# Altium schematic sheet JunPuMBUS.SchDoc
size A3
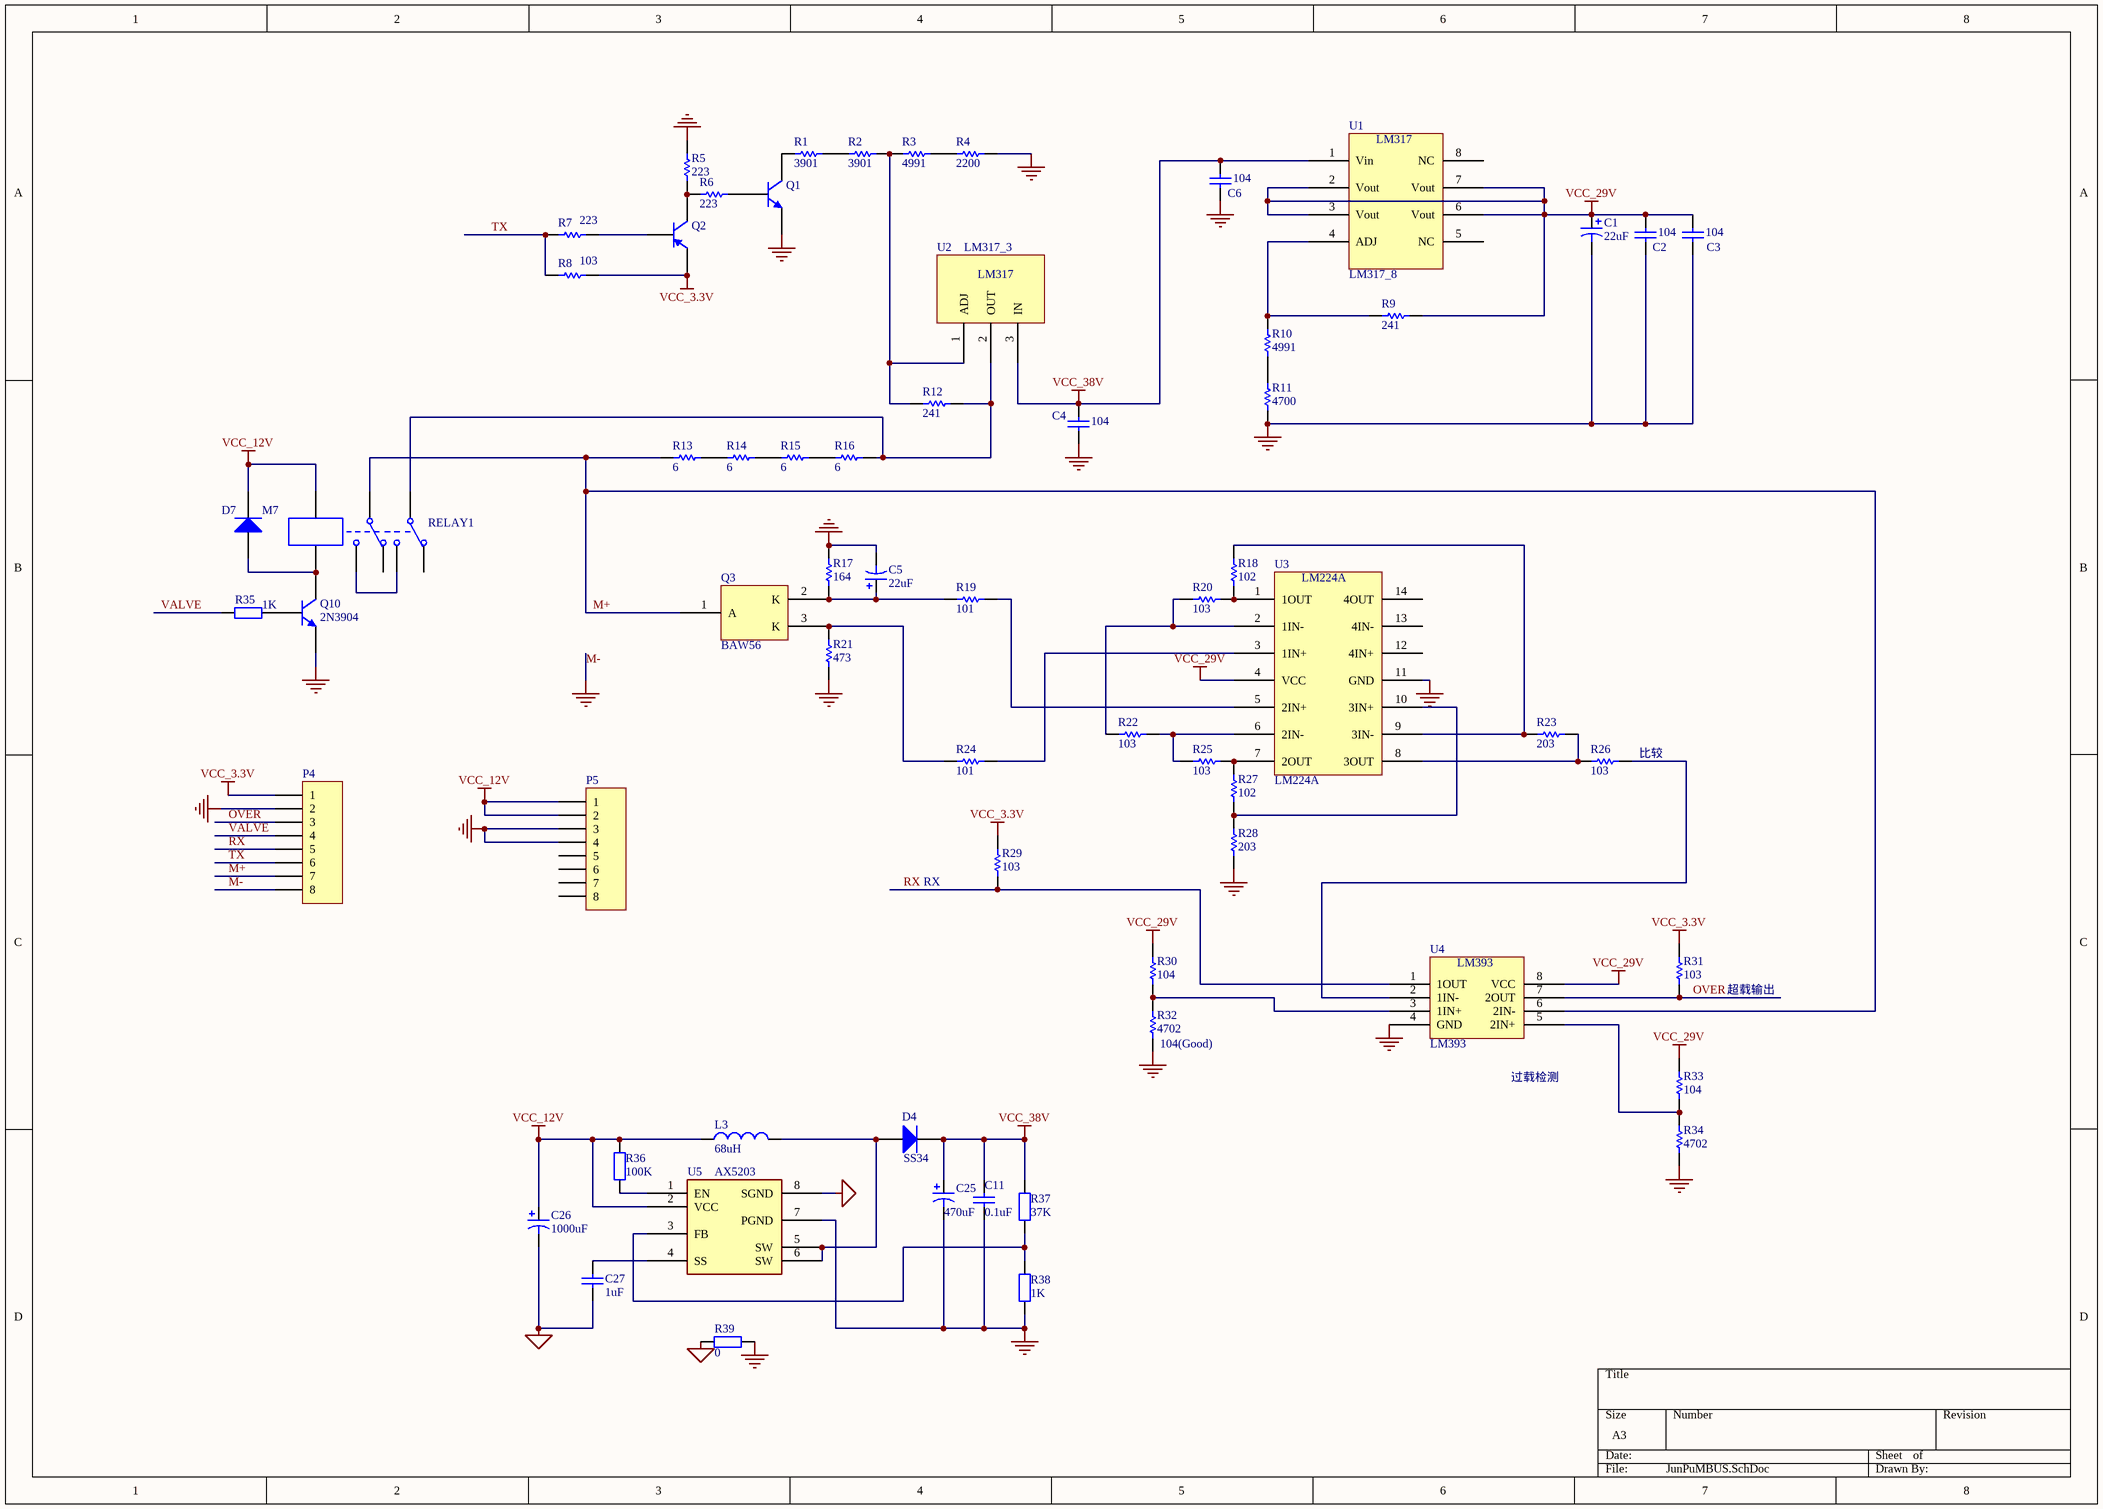
[diagram p0: JunPuMBUS.SchDoc]

## Parts
C1  value 22uF  [C_6.3_5.3]  (hidden comment: Cap Pol3)
C2  value 104  [0603]  (hidden comment: Cap)
C3  value 104  [0603]  (hidden comment: Cap)
C4  value 104  [0603]  (hidden comment: Cap)
C5  value 22uF  [C_6.3_5.3]  (hidden comment: Cap Pol3)
C6  value 104  [0603]  (hidden comment: Cap)
C11  value 0.1uF  [0603]  (hidden comment: Cap)
C25  value 470uF  [C_DJ - duplicate]  (hidden comment: Cap Pol1)
C26  value 1000uF  [C_DJ - duplicate]  (hidden comment: Cap Pol1)
C27  value 1uF  [0603]  (hidden comment: Cap)
D4  SS34  [M7-4007]
D7  M7  [M7-4007]
L3  value 68uH  [L12*12]  (hidden comment: Inductor)
P4  Header 8  [HDR1X8]  (value not drawn)
P5  Header 8  [HDR1X8]  (value not drawn)
Q1  NPN  [SOT-23]  (value not drawn)
Q2  PNP  [SOT-23]  (value not drawn)
Q3  BAW56  [SOT-23]
Q10  2N3904  [NPN-PNP]
R1  value 3901  [1206]  (hidden comment: Res1)
R2  value 3901  [1206]  (hidden comment: Res1)
R3  value 4991  [1206]  (hidden comment: Res1)
R4  value 2200  [1206]  (hidden comment: Res1)
R5  value 223  [0603]  (hidden comment: Res1)
R6  value 223  [0603]  (hidden comment: Res1)
R7  value 223  [0603]  (hidden comment: Res1)
R8  value 103  [0603]  (hidden comment: Res1)
R9  value 241  [1206]  (hidden comment: Res1)
R10  value 4991  [1206]  (hidden comment: Res1)
R11  value 4700  [1206]  (hidden comment: Res1)
R12  value 241  [1206]  (hidden comment: Res1)
R13  value 6  [2512]  (hidden comment: Res1)
R14  value 6  [2512]  (hidden comment: Res1)
R15  value 6  [2512]  (hidden comment: Res1)
R16  value 6  [2512]  (hidden comment: Res1)
R17  value 164  [0603]  (hidden comment: Res1)
R18  value 102  [0603]  (hidden comment: Res1)
R19  value 101  [0603]  (hidden comment: Res1)
R20  value 103  [0603]  (hidden comment: Res1)
R21  value 473  [0603]  (hidden comment: Res1)
R22  value 103  [0603]  (hidden comment: Res1)
R23  value 203  [0603]  (hidden comment: Res1)
R24  value 101  [0603]  (hidden comment: Res1)
R25  value 103  [0603]  (hidden comment: Res1)
R26  value 103  [0603]  (hidden comment: Res1)
R27  value 102  [0603]  (hidden comment: Res1)
R28  value 203  [0603]  (hidden comment: Res1)
R29  value 103  [0603]  (hidden comment: Res1)
R30  value 104  [1206]  (hidden comment: Res1)
R31  value 103  [0603]  (hidden comment: Res1)
R32  104(Good)  value 4702  [1206]
R33  value 104  [1206]  (hidden comment: Res1)
R34  value 4702  [1206]  (hidden comment: Res1)
R35  value 1K  [0603]  (hidden comment: Res2)
R36  value 100K  [0603]  (hidden comment: Res2)
R37  value 37K  [0603]  (hidden comment: Res2)
R38  value 1K  [0603]  (hidden comment: Res2)
R39  value 0  [0603]  (hidden comment: Res2)
RELAY1  Relay-DPDT  [Relay-DPDP]  (value not drawn)
U1  LM317_8  [SOP8]
U2  LM317_3  [LM317_3]
U3  LM224A  [SOP14]
U4  LM393  [SOP8]
U5  AX5203  [SOP8]

## Nets
M-: C1.2 C2.1 C3.1 C4.1 C5.2 C6.1 C11.1 C25.2 P4.2 P4.8 P5.3 P5.4 Q1.3(E) Q10.E R4.1 R5.2 R11.2 R17.2 R21.1 R28.2 R32.2 R34.2 R38.2 R39.1 U3.11(GND) U4.4(GND) U5.7(PGND)  [also labelled GND]
SGND: C26.2 C27.1 R39.2 U5.8(SGND)
VCC_3.3V: P4.1 Q2.3(E) R8.2 R29.2 R31.2
VCC_12V: C26.1 D7.2(K) L3.2 P5.1 P5.2 R36.1 RELAY1.7 U5.2(VCC)
VCC_29V: C1.1 C2.2 C3.2 R9.1 R30.1 R33.1 U1.2(Vout) U1.3(Vout) U1.6(Vout) U1.7(Vout) U3.4(VCC) U4.8(VCC)
VCC_38V: C4.2 C6.2 C11.2 C25.1 D4.2(K) R37.1 U1.1(Vin) U2.3(IN)
M+: P4.7 Q3.1(A) R13.1 RELAY1.4 U4.6(2IN-)
OVER: P4.3 R31.1 U4.7(2OUT)
RX: P4.5 R29.1 U4.1(1OUT)
TX: P4.6 R7.1 R8.1
VALVE: P4.4 R35.1
NetC5_1: C5.1 Q3.2(K) R17.1 R19.1
NetC27_2: C27.2 U5.4(SS)
NetD4_1: D4.1(A) L3.1 U5.5(SW) U5.6(SW)
NetD7_1: D7.1(A) Q10.C RELAY1.8
NetQ1_1: Q1.1(C) R1.2
NetQ1_2: Q1.2(B) R6.1
NetQ2_1: Q2.1(C) R5.1 R6.2
NetQ2_2: Q2.2(B) R7.2
NetQ3_3: Q3.3(K) R21.2 R24.1
NetQ10_B: Q10.B R35.2
NetR1_1: R1.1 R2.2
NetR2_1: R2.1 R3.2 R12.2 U2.1(ADJ)
NetR3_1: R3.1 R4.2
NetR9_2: R9.2 R10.1 U1.4(ADJ)
NetR10_2: R10.2 R11.1
NetR12_1: R12.1 R16.2 RELAY1.1 U2.2(OUT)
NetR13_2: R13.2 R14.1
NetR14_2: R14.2 R15.1
NetR15_2: R15.2 R16.1
NetR18_1: R18.1 R23.2 U3.9(3IN-)
NetR18_2: R18.2 R20.1 U3.1(1OUT)
NetR19_2: R19.2 U3.5(2IN+)
NetR20_2: R20.2 R22.1 U3.2(1IN-)
NetR22_2: R22.2 R25.2 U3.6(2IN-)
NetR23_1: R23.1 R26.2 U3.8(3OUT)
NetR24_2: R24.2 U3.3(1IN+)
NetR25_1: R25.1 R27.1 U3.7(2OUT)
NetR26_1: R26.1 U4.2(1IN-)
NetR27_2: R27.2 R28.1 U3.10(3IN+)
NetR30_2: R30.2 R32.1 U4.3(1IN+)
NetR33_2: R33.2 R34.1 U4.5(2IN+)
NetR36_2: R36.2 U5.1(EN)
NetR37_2: R37.2 R38.1 U5.3(FB)
NetRELAY1_3: RELAY1.3 RELAY1.6

Not connected (* = marked no-connect by the designer): P5 5 6 7 8; RELAY1 2 5; U1 5(NC) 8(NC); U3 12(4IN+) 13(4IN-) 14(4OUT)

## Notes on the sheet
- (near R26) 比较
- RX
- (near R31) 超载输出
- (near U4) 过载检测
- (in symbol LM317_3) LM317
- (in symbol LM317_8) LM317

## Library data of the parts
C1 C5 = Cap Pol3: Polarized Capacitor (Surface Mount); Published: 8-Jun-2000; LatestRevisionDate: 17-Jul-2002; LatestRevisionNote: Re-released for DXP Platform.; PackageReference: C0805; Publisher: Altium Limited
C2-C4 C6 C11 C27 = Cap: Capacitor; Published: 8-Jun-2000; LatestRevisionDate: 17-Jul-2002; LatestRevisionNote: Re-released for DXP Platform.; PackageReference: RAD-0.3; Publisher: Altium Limited
C25 C26 = Cap Pol1: Polarized Capacitor (Radial); Published: 8-Jun-2000; LatestRevisionDate: 17-Jul-2002; LatestRevisionNote: Re-released for DXP Platform.; PackageReference: RB7.6-15; Publisher: Altium Limited
D4 D7 = Diode 1N4007: 1 Amp General Purpose Rectifier; Published: 8-Jun-2000; LatestRevisionDate: 17-Jul-2002; LatestRevisionNote: Re-released for DXP Platform.; PackageReference: DO-41; Publisher: Altium Limited; Code_JEDEC: DO-204-AL; ComponentLink1Description: Manufacturer Link; ComponentLink1URL: http://www.fairchildsemi.com/; ComponentLink2Description: Datasheet; ComponentLink2URL: http://www.fairchildsemi.com/ds/1N%2F1N4001.pdf
  D4: DatasheetVersion: 1998; PackageVersion: Aug-1999
  D7: DatasheetDocument: 1998; PackageDocument: Aug-1999
L3 = Inductor: Code_IEC: 1005; Published: 8-Jun-2000; LatestRevisionDate: 29-May-2009; LatestRevisionNote: IPC-7351 Footprint Added.; PackageReference: 0402-A; Publisher: Altium Limited; PackageDescription: Chip Inductor; Code_JEITA: 0402
P4 P5 = Header 8: Header, 8-Pin; LatestRevisionDate: 17-Jul-2002; LatestRevisionNote: Re-released for DXP Platform.; Publisher: Altium Limited
Q1 = NPN: NPN General Purpose Amplifier; Published: 8-Jun-2000; LatestRevisionDate: 15-Jan-2003; LatestRevisionNote: PCB Footprint 'BCY-W3/D4.7' replaced; DatasheetVersion: 1997; PackageVersion: Sep-1998; PackageReference: TO-92A; Publisher: Altium Limited; Code_JEDEC: TO-92A; ComponentLink1Description: Manufacturer Link; ComponentLink1URL: http://www.fairchildsemi.com/; ComponentLink2Description: Datasheet; ComponentLink2URL: http://www.fairchildsemi.com/ds/2N%2F2N3904.pdf
Q2 = PNP: PNP Bipolar Transistor; Published: 8-Jun-2000; LatestRevisionDate: 17-Jul-2002; LatestRevisionNote: Re-released for DXP Platform.; PackageReference: SOT-23B; Publisher: Altium Limited; Code_JEDEC: SOT-23
Q10 = 2N3904: NPN General Purpose Amplifier; Published: 8-Jun-2000; LatestRevisionDate: 15-Jan-2003; LatestRevisionNote: PCB Footprint 'BCY-W3/D4.7' replaced; DatasheetDocument: 1997; PackageDocument: Sep-1998; PackageReference: TO-92A; Publisher: Altium Limited; Code_JEDEC: TO-92A; ComponentLink1Description: Manufacturer Link; ComponentLink1URL: http://www.fairchildsemi.com/; ComponentLink2Description: Datasheet; ComponentLink2URL: http://www.fairchildsemi.com/ds/2N%2F2N3904.pdf
R1-R34 = Res1: Resistor; Published: 8-Jun-2000; LatestRevisionDate: 17-Jul-2002; LatestRevisionNote: Re-released for DXP Platform.; PackageReference: AXIAL-0.3; Publisher: Altium Limited
R35-R39 = Res2: Resistor; Published: 8-Jun-2000; LatestRevisionDate: 17-Jul-2002; LatestRevisionNote: Re-released for DXP Platform.; PackageReference: AXIAL-0.4; Publisher: Altium Limited
RELAY1 = Relay-DPDT: Dual-Pole Dual-Throw Relay; Published: 24-Mar-1999; LatestRevisionDate: 17-Jul-2002; LatestRevisionNote: Re-released for DXP Platform.; PackageReference: DIP-P8; Publisher: Altium Limited